# EAGLE design googleShoes_rev04_r (EAGLE 6.2)
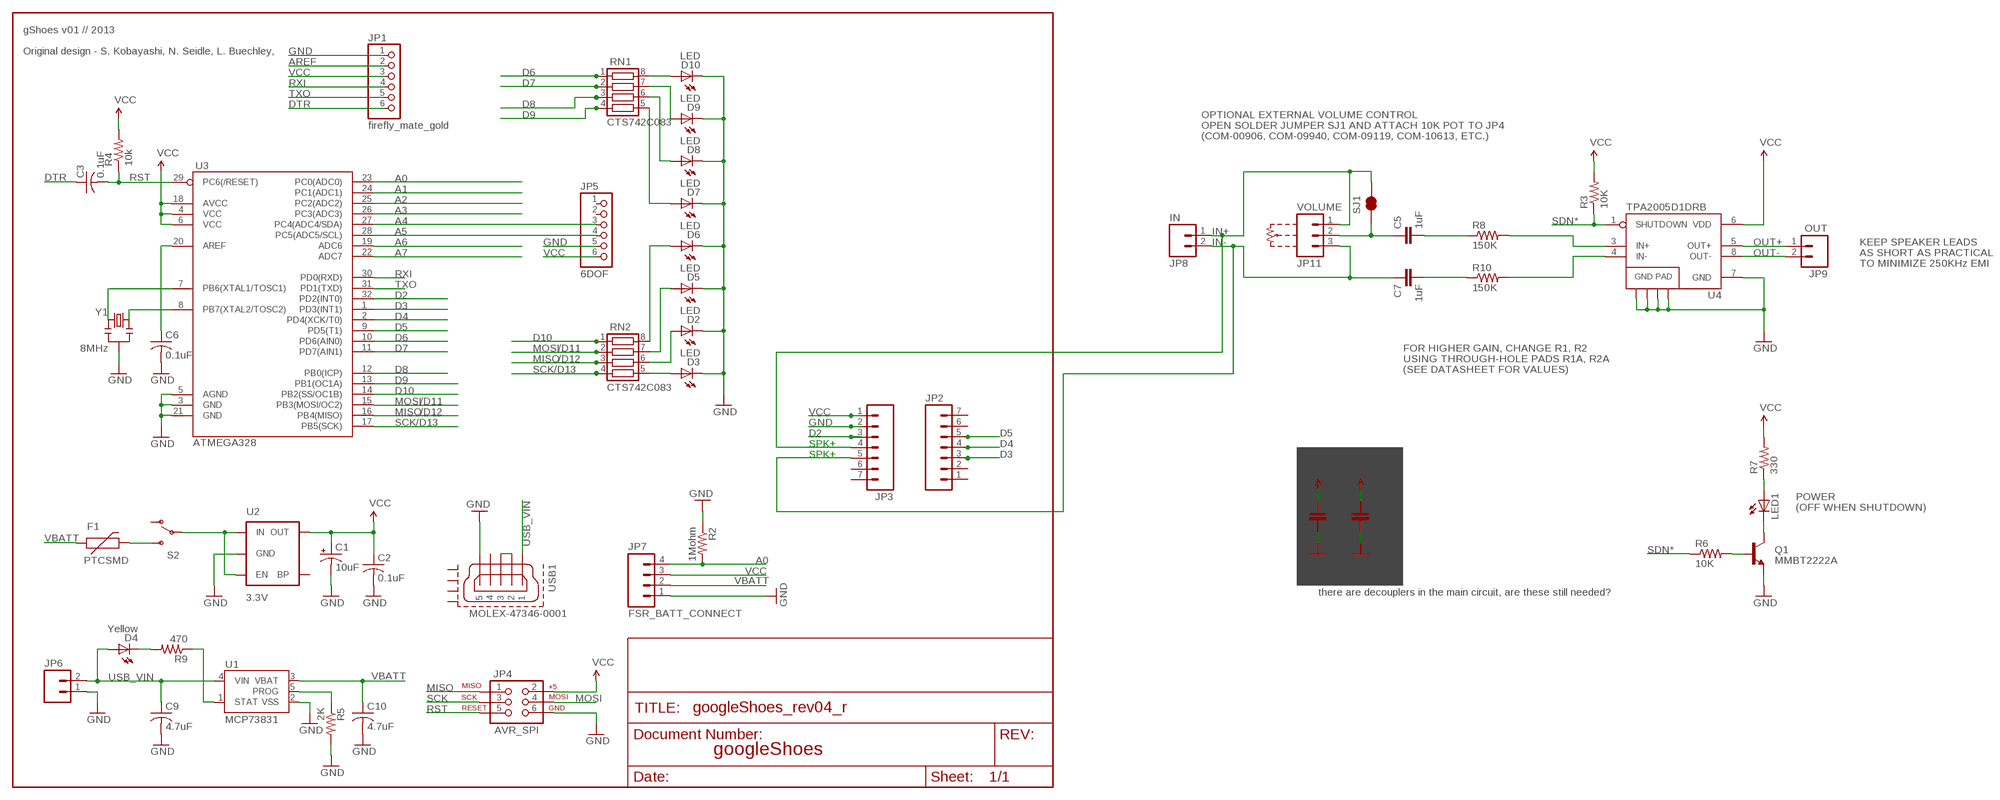
[diagram p0: schematic, sheet 1]

## Parts
C1  10uF  CAP_POL1206  [EIA3216]
C2  0.1uF  C-USC0805  [C0805]
C3  0.1uF  C-USC0805  [C0805]
C4  1uF  CAP1206  [1206]
C5  1uF  CAP1206  [1206]
C6  0.1uF  C-USC0805  [C0805]
C7  1uF  CAP1206  [1206]
C8  10uF  CAP1206  [1206]
C9  4.7uF  C-USC0805  [C0805]
C10  4.7uF  C-USC0805  [C0805]
D2  LED  LEDCHIP-LED0805  [CHIP-LED0805]
D3  LED  LEDCHIP-LED0805  [CHIP-LED0805]
D4  Yellow  LEDCHIP-LED0805  [CHIP-LED0805]
D5  LED  LEDCHIP-LED0805  [CHIP-LED0805]
D6  LED  LEDCHIP-LED0805  [CHIP-LED0805]
D7  LED  LEDCHIP-LED0805  [CHIP-LED0805]
D8  LED  LEDCHIP-LED0805  [CHIP-LED0805]
D9  LED  LEDCHIP-LED0805  [CHIP-LED0805]
D10  LED  LEDCHIP-LED0805  [CHIP-LED0805]
F1  PTCSMD  [PTC-1206]
JP1  firefly_mate_gold  PINHD-1X6B  [1X06-BIG]
JP2  M07  [1X07]
JP3  M07  [1X07]
JP4  AVR_SPI  AVR_SPI_PRG_6PTH  [2X3]
JP5  6DOF  PINHD-1X6B  [1X06-BIG]
JP6  M02PTH  [1X02]
JP7  FSR_BATT_CONNECT  M04PTH  [1X04]
JP8  IN  M02PTH  [1X02]
JP9  OUT  M02PTH  [1X02]
JP11  VOLUME  M03PTH  [1X03]
LED1  LEDCHIPLED_0805  [CHIPLED_0805]
Q1  MMBT2222A  TRANSISTOR_NPNSOT23-3  [SOT23-3]
R2  1Mohm  R-US_M0805  [M0805]
R3  10K  R-US_M0805  [M0805]
R4  10k  R-US_M0805  [M0805]
R5  2K  R-US_M0805  [M0805]
R6  10K  R-US_M0805  [M0805]
R7  330  R-US_M0805  [M0805]
R8  150K  R-US_M0805  [M0805]
R9  470  R-US_M0805  [M0805]
R10  150K  R-US_M0805  [M0805]
RN1  CTS742C083  [CTS742C083]
RN2  CTS742C083  [CTS742C083]
S2  SWITCH-SPSTSMD  [AYZ0202]
SJ1  SOLDERJUMPERNC2  [SJ_2S-NOTRACE]
U1  MCP73831  MCP73831SMD  [SOT23-5]
U2  3.3V  V_REG_LDOSMD  [SOT23-5]
U3  ATMEGA328  ATMEGA168  [TQFP32-08]
U4  TPA2005D1DRB  [QFN-8_PAD]
USB1  MOLEX-47346-0001  [MOLEX-47364-0001]
Y1  8MHz  RESONATORSMD  [RESONATOR-SMD]

## Nets
A0: JP7.4 R2.2 U3.23(PC0(ADC0))
A1: U3.24(PC1(ADC1))
A2: U3.25(PC2(ADC2))
A3: U3.26(PC3(ADC3))
A4: JP5.3 U3.27(PC4(ADC4/SDA))
A5: JP5.4 U3.28(PC5(ADC5/SCL))
A6: U3.19(ADC6)
A7: U3.22(ADC7)
AREF: C6.1 JP1.2 U3.20(AREF)
D2: JP3.3 U3.32(PD2(INT0))
D3: JP2.3 U3.1(PD3(INT1))
D4: JP2.4 U3.2(PD4(XCK/T0))
D5: JP2.5 U3.9(PD5(T1))
D6: RN1.1 U3.10(PD6(AIN0))
D7: RN1.2 U3.11(PD7(AIN1))
D8: RN1.3 U3.12(PB0(ICP))
D9: RN1.4 U3.13(PB1(OC1A))
D10: RN2.1 U3.14(PB2(SS/OC1B))
DTR: C3.1 JP1.6
GND: C1.C(-) C2.2 C4.2 C6.2 C8.2 C9.2 C10.2 D2.C D3.C D5.C D6.C D7.C D8.C D9.C D10.C JP1.1 JP3.2 JP4.6 JP5.5 JP6.1 JP7.1 Q1.2(E) R2.1 R5.2 U1.2(VSS) U2.2(GND) U3.3(GND) U3.5(AGND) U3.21(GND) U4.7(GND) U4.10(GND) U4.11(GND) U4.12(GND) U4.13(GND) USB1.5 Y1.2
IN+: JP3.4 JP8.1 JP11.1 SJ1.2
IN+AMP: R8.2 U4.3(IN+)
IN-: C7.1 JP3.5 JP8.2 JP11.3
IN-AMP: R10.2 U4.4(IN-)
MISO: JP4.1 RN2.3 U3.16(PB4(MISO))
MOSI: JP4.4 RN2.2 U3.15(PB3(MOSI/OC2))
N$1: C5.1 JP11.2 SJ1.1
N$3: D3.A RN2.5
N$4: D2.A RN2.6
N$5: S2.2(P) U2.1(IN) U2.3(EN)
N$6: D5.A RN2.7
N$7: D6.A RN2.8
N$8: D4.C R9.2
N$9: F1.2 S2.3(S)
N$10: U3.7(PB6(XTAL1/TOSC1)) Y1.3
N$11: R5.1 U1.5(PROG)
N$12: U3.8(PB7(XTAL2/TOSC2)) Y1.1
N$13: D10.A RN1.8
N$14: R9.1 U1.1(STAT)
N$15: D9.A RN1.7
N$16: D8.A RN1.6
N$17: D7.A RN1.5
N$18: LED1.A R7.1
N$19: Q1.1(B) R6.2
N$20: LED1.C Q1.3(C)
N$21: C5.2 R8.1
N$22: C7.2 R10.1
N$23: USB1.2 USB1.3
OUT+: JP9.1 U4.5(OUT+)
OUT-: JP9.2 U4.8(OUT-)
RST: C3.2 JP4.5 R4.1 U3.29(PC6(/RESET))
RXI: JP1.4 U3.30(PD0(RXD))
SCK: JP4.3 RN2.4 U3.17(PB5(SCK))
SDN*: R3.1 R6.1 U4.1(SHUTDOWN)
TXO: JP1.5 U3.31(PD1(TXD))
USB_VIN: C9.1 D4.A JP6.2 U1.4(VIN) USB1.1
VBATT: C10.1 F1.1 JP7.2 U1.3(VBAT)
VCC [VCC]: C1.A(+) C2.1 C4.1 C8.1 JP1.3 JP3.1 JP4.2 JP5.6 JP7.3 R3.2 R4.2 R7.2 U2.5(OUT) U3.4(VCC) U3.6(VCC) U3.18(AVCC) U4.6(VDD)
Unconnected: JP2.1 JP2.2 JP2.6 JP2.7 JP3.6 JP3.7 JP5.1 JP5.2 S2.1(O) U2.4(BP) USB1.4 USB1.GND1 USB1.GND2 USB1.GND3 USB1.GND4

## Notes on the sheet
- gShoes v01 // 2013
- Original design - S. Kobayashi, N. Seidle, L. Buechley,
- OPTIONAL EXTERNAL VOLUME CONTROL
- OPEN SOLDER JUMPER SJ1 AND ATTACH 10K POT TO JP4
- (COM-00906, COM-09940, COM-09119, COM-10613, ETC.)
- KEEP SPEAKER LEADS
- AS SHORT AS PRACTICAL
- TO MINIMIZE 250KHz EMI
- /D11 | FOR HIGHER GAIN, CHANGE R1, R2
- /D12 | USING THROUGH-HOLE PADS R1A, R2A
- /D13 | (SEE DATASHEET FOR VALUES)
- /D11
- /D12
- /D13
- SPK+
- SPK+
- POWER
- (OFF WHEN SHUTDOWN)
- there are decouplers in the main circuit, are these still needed?
- googleShoes

## Library data of the parts
C1 = SparkFun:CAP_POL: Capacitor Polarized These are standard SMD and PTH capacitors. Normally 10uF, 47uF, and 100uF in electrolytic and tantalum varieties. Always verify the external diameter of the through hole cap, it varies with capacity, voltage, and manufacturer. The EIA devices should be standard.
C2 C3 C6 C9 C10 = adafruit:C-US: CAPACITOR, American symbol
C4 C5 C7 C8 = SparkFun:CAP: Capacitor Standard 0603 ceramic capacitor, and 0.1" leaded capacitor.
D2-D10 = adafruit:LED: LED
F1 = SparkFun:PTC: Resettable Fuse PTC Resettable Fuse. Spark Fun Electronics SKU : COM-08357
JP1 JP5 = adafruit:PINHD-1X6: PIN HEADER
JP2 JP3 = SparkFun-Connectors:M07: Header 7 Standard 7-pin 0.1" header. Use with straight break away headers (SKU : PRT-00116), right angle break away headers (PRT-00553), swiss pins (PRT-00743), machine pins (PRT-00117), and female headers (PRT-00115). NOTES ON THE VARIANTS LOCK and LOCK_LONGPADS... This footprint was designed to help hold the alignment of a through-hole component (i.e. 7-pin header) while soldering it into place. You may notice that each hole has been shifted either up or down by 0.005 of an inch from it's more standard position (which is usually a perfectly straight line). This slight alteration caused the pins (the squares in the middle) to touch the edges of the holes. Because they are alternating, it causes a "brace" to hold the header in place. 0.005 has proven to be the perfect amount of "off-center" position when using our standard breakaway headers. Although looks a little odd when you look at the bare footprint, once you have a header in there, the alteration is very hard to notice. Also, if you push a header all the way into place, it is covered up entirely on the bottom side. This idea of altering the position of holes to aid alignment will be further integrated into the Sparkfun Library for other footprints. It can help hold any component with 3 or more connection pins.
JP4 = SparkFun:AVR_SPI_PRG_6: AVR ISP 6 Pin This is the reduced ISP connector for AVR programming. Common on Arduino. This footprint will take up less PCB space and can be used with a 10-pin to 6-pin adapter such as SKU: BOB-08508
JP6 JP8 JP9 = SparkFun:M02: Header 2 Standard 2-pin 0.1" header. Use with straight break away headers (SKU : PRT-00116), right angle break away headers (PRT-00553), swiss pins (PRT-00743), machine pins (PRT-00117), and female headers (PRT-00115). Molex polarized connector foot print use with SKU : PRT-08233 with associated crimp pins and housings.
JP7 = SparkFun-Connectors:M04: Header 4 Standard 4-pin 0.1" header. Use with straight break away headers (SKU : PRT-00116), right angle break away headers (PRT-00553), swiss pins (PRT-00743), machine pins (PRT-00117), and female headers (PRT-00115). Molex polarized connector foot print use with SKU : PRT-08231 with associated crimp pins and housings. 1MM SMD Version SKU: PRT-10208
JP11 = SparkFun:M03: Header 3 Standard 3-pin 0.1" header. Use with straight break away headers (SKU : PRT-00116), right angle break away headers (PRT-00553), swiss pins (PRT-00743), machine pins (PRT-00117), and female headers (PRT-00115). Molex polarized connector foot print use with SKU : PRT-08232 with associated crimp pins and housings.
LED1 = led:LED: LED
Q1 = SparkFun:TRANSISTOR_NPN: Transistor NPN BJT configuration in SOT23 package. MMBT2222 is the common NPN we use. Double check BCE configuration again layout.
R2 R4 R5 R9 = rcl:R-US_: RESISTOR, American symbol
R3 R6-R8 R10 = resistor:R-US_: RESISTOR, American symbol
RN1 RN2 = resistor-net:CTS742C083: Chip Resistor Array 4 Single Resistor Source: http://www.ctscorp.com/components/Datasheets/CTSChipArrayDs.pdf; OC_FARNELL: unknown; OC_NEWARK: unknown
S2 = SparkFun:SWITCH-SPST: SPST Switch Simple slide switch. Spark Fun Electronics SKU : COM-00102
SJ1 = SparkFun:SOLDERJUMPER: Solder Jumper Standard SMD solder jumper. Used to automate production. Two varients : Normally Open and Normally Closed are the same, but have different paste layers. NC will have a large amount of paste and should jumper during reflow.
U1 = SparkFun:MCP73831
U2 = SparkFun:V_REG_LDO: Voltage Regulator LDO Standard 150mA LDO voltage regulator in SOT-23 layout. Micrel part MIC5205. BP (by-pass) pin is used to lower output noise with 470pF cap.
U3 = SparkFun:ATMEGA168
U4 = mike-temp:TPA2005D1: 1.4W MONO CLASS-D AUDIO POWER AMPLIFIER The TPA2005D1 is a 1.4-W high efficiency filter-free class-D audio power amplifier in a BGA, QFN, or MSOP package that requires only three external components. Datasheet: http://focus.ti.com/lit/ds/symlink/tpa2005d1.pdf 1.4 W Into 8 ? From a 5V Supply at THD = 10% (Typ) Maximum Battery Life and Minimum Heat Efficiency With an 8-? Speaker: 84% at 400 mW, 79% at 100 mW 2.8-mA Quiescent Current 0.5-mA Shutdown Current Ideal for Wireless or Cellular Handsets and PDAs Capable of Driving an 8-? Speaker (2.5 V ? VDD ? 5.5 V) and a 4-? Speaker (2.5 V ? VDD ? 4.2 V) Only Three External Components Optimized PWM Output Stage Eliminates LC Output Filter Internally Generated 250-kHz Switching Frequency Eliminates Capacitor and Resistor Improved PSRR (-71 dB at 217 Hz) and Wide Supply Voltage (2.5 V to 5.5 V) Eliminates Need for a Voltage Regulator Fully Differential Design Reduces RF Rectification and Eliminates Bypass Capacitor Improved CMRR Eliminates Two Input Coupling Capacitors
USB1 = usb_con-update:MOLEX-47346-0001: MICRO USB B, BOTTOM MOUNT
Y1 = SparkFun:RESONATOR: Resonator Small SMD resonator. This is the itty bitty 10/20MHz resonators with built in caps. CSTCE10M0G55 and CSTCE20M0V53. Footprint has been reviewed closely but hasn't been tested yet.

## Net classes
0 Default: width 0.203 mm
1 VCC: width 0.381 mm
2 LEDPower: width 0.203 mm
3 ButtonSignal: width 0.203 mm

## Board
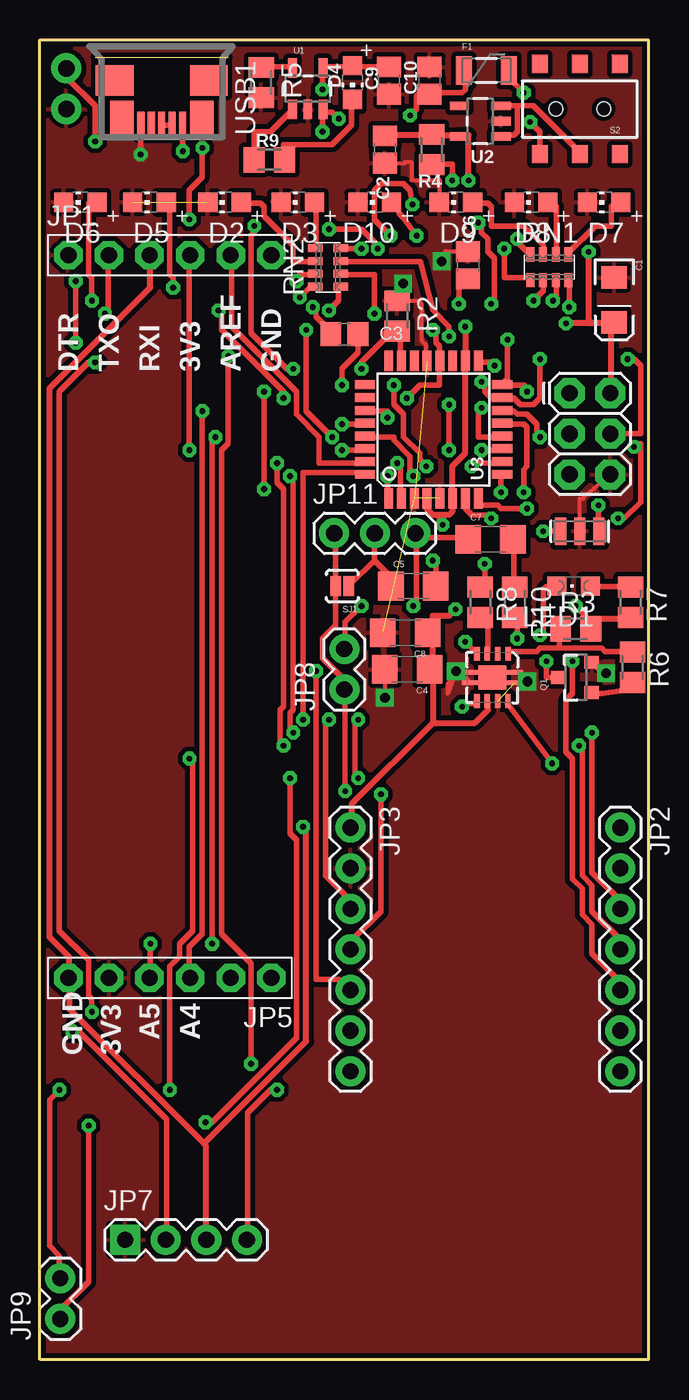
[diagram p1: board, top side]
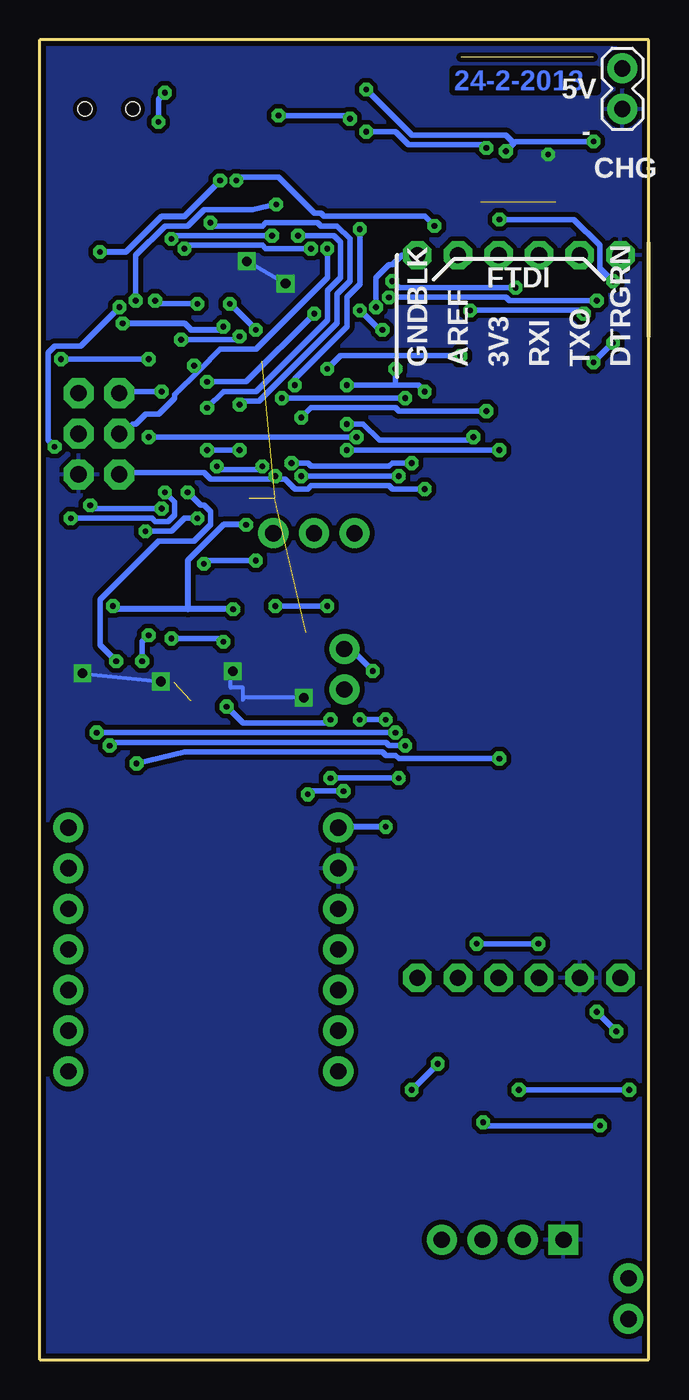
[diagram p2: board, bottom side, seen from below]

Size 38.1 x 82.55 mm. Coordinates in mm from the lower left corner, seen from the top.
Outline: 38.1,0 0,0 0,82.55 38.1,82.55 38.1,0
Copper layers (1*16): Top 0.035mm / dielectric 1.5mm / Bottom 0.035mm
Design rules: minimum track width 14mil, minimum drill 14mil, track to track 8mil, track to pad 8mil, pad to pad 8mil, via to via 4mil, smd to smd 8mil, copper to edge 8mil, drill to drill 8mil, minimum pad ring 12mil, minimum via ring 10mil, stop-mask expansion 4mil, vias tented up to drill 20mil, thermal gap 10mil

### Footprints (pad centres in the part's own frame; a part is rotated, then mirrored left to right if it is on the bottom)
EIA3216 = smd 1.4 x 1.6: A 1.4,0; C -1.4,0
C0805 = smd 1.3 x 1.5: 1 -0.85,0; 2 0.85,0
1206 = smd 1.6 x 1.8: 1 -1.4,0; 2 1.4,0
CHIP-LED0805 = smd 1.2 x 1.2: A 0,-1.05; C 0,1.05
PTC-1206 = smd 1 x 1.8: 1 -1.4,0; 2 1.4,0
1X06-BIG = drill 1.016 pad 1.778 octagon: 1 -6.35,0; 2 -3.81,0; 3 -1.27,0; 4 1.27,0; 5 3.81,0; 6 6.35,0
1X07 = drill 1.016 pad 1.88: 1 0,0; 2 2.54,0; 3 5.08,0; 4 7.62,0; 5 10.16,0; 6 12.7,0; 7 15.24,0
2X3 = drill 1.016 pad 1.88 octagon: 1 0,0; 2 0,2.54; 3 2.54,0; 4 2.54,2.54; 5 5.08,0; 6 5.08,2.54
1X02 = drill 1.016 pad 1.88: 1 0,0; 2 2.54,0
1X04 = drill 1.016 pad 1.88 square: 1 0,0 | drill 1.016 pad 1.88: 2 2.54,0; 3 5.08,0; 4 7.62,0
1X03 = drill 1.016 pad 1.88: 1 0,0; 2 2.54,0; 3 5.08,0
CHIPLED_0805 = smd 1.2 x 1.2: A 0,-1.05; C 0,1.05
SOT23-3 = smd 0.8 x 0.9: 1 -0.95,-1; 2 0.95,-1; 3 0,1.1
M0805 = smd 1.3 x 1.6: 1 -0.95,0; 2 0.95,0
CTS742C083 = smd 0.5 x 0.9: 1 -1.2,-0.8; 2 -0.4,-0.8; 3 0.4,-0.8; 4 1.2,-0.8; 5 1.2,0.8; 6 0.4,0.8; 7 -0.4,0.8; 8 -1.2,0.8
AYZ0202 = smd 1 x 1.15: 1 -2.5,2.825; 2 0,2.825; 3 2.5,2.825; 4 -2.5,-2.825; 5 0,-2.825; 6 2.5,-2.825 | hole 0.85: 1.5,0; -1.5,0
SJ_2S-NOTRACE = smd 0.635 x 1.27: 1 -0.401,0; 2 0.413,0
SOT23-5 = smd 0.55 x 1.2: 1 -0.95,-1.3; 2 0,-1.3; 3 0.95,-1.3; 4 0.95,1.3; 5 -0.95,1.3
TQFP32-08 = smd 1.27 x 0.559: 1 -4.293,2.8; 2 -4.293,2; 3 -4.293,1.2; 4 -4.293,0.4; 5 -4.293,-0.4; 6 -4.293,-1.2; 7 -4.293,-2; 8 -4.293,-2.8; 17 4.293,-2.8; 18 4.293,-2; 19 4.293,-1.2; 20 4.293,-0.4; 21 4.293,0.4; 22 4.293,1.2; 23 4.293,2; 24 4.293,2.8 | smd 0.559 x 1.27: 9 -2.8,-4.293; 10 -2,-4.293; 11 -1.2,-4.293; 12 -0.4,-4.293; 13 0.4,-4.293; 14 1.2,-4.293; 15 2,-4.293; 16 2.8,-4.293; 25 2.8,4.293; 26 2,4.293; 27 1.2,4.293; 28 0.4,4.293; 29 -0.4,4.293; 30 -1.2,4.293; 31 -2,4.293; 32 -2.8,4.293
QFN-8_PAD = smd 0.35 x 0.85: 1 -0.975,-1.475; 2 -0.325,-1.475; 3 0.325,-1.475; 4 0.975,-1.475; 5 0.975,1.475; 6 0.325,1.475; 7 -0.325,1.475; 8 -0.975,1.475 | smd 1.75 x 1.5: 9 0,0 | smd 1.025 x 0.28: 10 -1.387,-0.325; 11 1.387,-0.325; 12 1.387,0.325; 13 -1.387,0.325
MOLEX-47364-0001 = smd 1.7 x 0.45: 1 2.8,1.3; 2 2.8,0.65; 3 2.8,0; 4 2.8,-0.65; 5 2.8,-1.3 | smd 1.9 x 2.375: GND1 0,2.95; GND4 0,-2.95 | smd 2.1 x 1.475: GND2 2.3,2.5; GND3 2.3,-2.5
RESONATOR-SMD = smd 0.7 x 1.7: 1 -1.2,0; 2 0,0; 3 1.2,0

### Placement (x,y rotation side)
C1  35.94,66.29 270 top
C2  21.59,75.69 270 top
C3  19.05,64.14 0 top
C4  22.99,43.18 180 top
C5  23.37,48.39 0 top
C6  26.8,68.45 90 top
C7  28.19,51.31 0 top
C8  22.86,45.47 180 top
C9  21.84,80.01 270 top
C10  24.38,80.01 90 top
D2  11.56,72.39 90 top
D3  16.13,72.39 90 top
D4  19.56,79.88 180 top
D5  6.86,72.39 90 top
D6  2.54,72.39 90 top
D7  35.31,72.39 90 top
D8  30.73,72.39 90 top
D9  26.04,72.39 90 top
D10  20.95,72.39 90 top
F1  27.94,80.64 0 top
JP1  8.13,69.09 0 top
JP2  36.32,33.27 270 top
JP3  19.43,33.27 270 top
JP4  33.15,60.45 270 top
JP5  8.13,23.88 180 top
JP6  1.65,78.23 90 bottom
JP7  5.33,7.49 0 top
JP8  19.05,41.91 90 top
JP9  1.27,2.54 90 top
JP11  18.41,51.69 0 top
LED1  33.4,48.39 90 top
Q1  33.53,42.67 90 top
R2  22.35,65.28 270 top
R3  33.53,45.72 0 top
R4  24.51,75.69 90 top
R5  13.84,79.88 270 top
R6  37.08,43.31 270 top
R7  36.96,47.37 270 top
R8  27.56,47.37 270 top
R9  14.35,75.06 0 top
R10  29.72,47.37 270 top
RN1  31.88,68.33 0 top
RN2  18.03,68.33 90 top
S2  33.78,78.23 180 top
SJ1  18.92,48.39 180 top
U1  16.76,79.5 0 top
U2  27.56,77.47 90 top
U3  24.63,58.18 90 top
U4  28.32,42.67 180 top
USB1  7.62,80.01 270 top
Y1  33.78,51.82 180 top

### Tracks (layer width: path | path; a pad name or v marks a point on that pad's centre or on a via)
A0  (via drill 0.36)
  Top 0.356: U3.23 22.55,62.59 22.55,64.01 R2.2 22.55,64.21 21.54,64.21 21.54,63.8 20.12,62.38 v20.12,61.98 | v11.79,62.79 11.79,57.3 11.38,56.9 11.38,26.62 13.21,24.79 v13.21,18.49 | v14.83,16.87 14.43,16.87 13.01,15.44 13.01,7.52 JP7.4
  Bottom 0.356: v20.12,61.98 19.3,62.79 v11.79,62.79 | v14.83,16.87 v13.21,18.49
A4  (via drill 0.36)
  Top 0.356: v21.74,58.93 21.74,59.33 20.52,59.33 U3.27 | v10.16,59.33 10.16,26.62 9.35,25.81 9.35,23.98 JP5.3
  Bottom 0.356: v21.74,58.93 21.13,59.54 15.85,59.54 15.65,59.33 v10.16,59.33
A5  (via drill 0.36)
  Top 0.356: v18.9,58.52 20.32,58.52 U3.28 | v10.97,57.71 10.77,57.51 v10.77,26.01 | v6.91,26.01 6.91,23.98 JP5.4
  Bottom 0.356: v18.9,58.52 17.88,58.52 16.87,57.51 11.18,57.51 v10.97,57.71 | v6.91,26.01 v10.77,26.01
AREF  (via drill 0.36)
  Top 0.356: v24.59,64.41 24.79,64.21 24.79,63.6 24.99,63.4 24.99,62.59 U3.20 24.99,62.38 24.99,60.96 23.77,60.96 v22.96,60.15 | v26.21,66.04 26.21,67.67 26.62,67.67 C6.1 | v4.06,65.43 4.27,65.63 4.27,69.09 JP1.2 | v11.18,65.63 11.38,65.43 11.38,64.41 15.24,60.55 v15.24,60.15
  Bottom 0.356: v26.21,66.04 v24.59,64.41 | v4.06,65.43 4.27,65.63 v11.18,65.63 | v22.96,60.15 v15.24,60.15
D2  (via drill 0.36)
  Top 0.356: v16.46,40.03 16.46,55.47 20.32,55.47 U3.32 | v18.09,40.03 17.88,39.83 17.88,30.28 19.51,28.65 19.51,28.25 JP3.3
  Bottom 0.356: v18.09,40.03 v16.46,40.03
D3  (via drill 0.36)
  Top 0.356: v21.74,55.27 21.74,54.05 U3.1 | v15.65,55.27 15.85,55.07 15.85,40.64 15.65,40.44 15.65,39.42 v15.85,39.22 | v34.54,39.22 34.54,30.48 36.37,28.65 36.37,28.25 JP2.3
  Bottom 0.356: v15.65,55.27 v21.74,55.27 | v34.54,39.22 v15.85,39.22
D4  (via drill 0.36)
  Top 0.356: v22.35,56.08 22.55,55.88 22.55,54.05 U3.2 | v14.83,56.08 14.83,54.86 15.24,54.46 15.24,40.84 15.04,40.64 15.04,38.61 v15.24,38.41 | v33.73,38.41 33.93,38.2 33.93,30.28 34.54,29.67 34.54,28.04 36.37,26.21 36.37,25.81 JP2.4
  Bottom 0.356: v22.35,56.08 21.34,56.08 21.13,55.88 16.26,55.88 16.05,56.08 v14.83,56.08 | v15.24,38.41 16.26,38.41 16.46,38.61 33.53,38.61 v33.73,38.41
D5  (via drill 0.36)
  Top 0.356: v28.85,54.25 28.85,55.27 U3.9 | v33.33,43.69 33.33,41.66 32.92,41.25 32.92,38 33.33,37.59 33.33,30.07 33.93,29.46 33.93,27.84 34.54,27.23 34.54,25.4 36.37,23.57 36.37,23.16 JP2.5
  Bottom 0.356: v28.85,54.25 28.04,53.44 27.84,53.44 27.43,53.03 27.43,52.22 28.45,51.21 30.68,51.21 34.34,47.55 34.34,44.7 v33.33,43.69
D6  (via drill 0.36)
  Top 0.356: v29.06,69.49 29.06,67.67 30.48,67.67 RN1.1 | v21.13,69.49 20.93,69.7 20.93,69.9 20.12,70.71 v18.09,70.71 | v22.15,60.96 22.15,59.74 22.76,59.13 22.76,57.71 23.77,56.69 23.77,56.29 v24.18,55.88 | v27.03,55.88 27.23,56.08 28.85,56.08 U3.10
  Bottom 0.356: v29.06,69.49 28.85,69.7 24.18,69.7 23.98,69.49 v21.13,69.49 | v18.09,70.71 18.09,67.26 18.9,66.45 18.9,64.62 22.15,61.37 v22.15,60.96 | v24.18,55.88 24.38,55.68 26.82,55.68 v27.03,55.88
D7  (via drill 0.36)
  Top 0.356: v30.89,66.24 31.5,66.85 31.5,67.46 RN1.2 | v28.25,66.04 28.45,66.24 28.45,68.89 28.04,69.29 28.04,70.1 27.64,70.51 27.64,70.92 v27.43,71.12 | v25.6,56.9 v25.6,59.74 | v27.64,56.9 28.85,56.9 U3.11
  Bottom 0.356: v30.89,66.24 30.68,66.04 v28.25,66.04 | v27.43,71.12 27.23,70.92 24.18,70.92 23.98,71.12 20.73,71.12 20.52,70.92 19.51,70.92 18.69,70.1 18.69,67.46 19.51,66.65 19.51,64.82 24.38,59.94 25.4,59.94 v25.6,59.74 | v27.64,56.9 v25.6,56.9
D8  (via drill 0.36)
  Top 0.356: v27.64,59.54 27.43,59.33 27.43,57.71 28.85,57.71 U3.12 | v21.95,70.31 20.93,71.32 20.93,73.15 21.34,73.56 22.76,73.56 23.16,73.15 v23.32,72.26 | v32.11,66.24 32.31,66.24 32.31,67.46 RN1.3
  Bottom 0.356: v27.64,59.54 26.62,60.55 24.59,60.55 20.12,65.02 20.12,66.85 19.3,67.67 19.3,69.9 19.71,70.31 v21.95,70.31 | v23.32,72.26 24.79,71.93 27.84,71.93 28.85,70.92 30.28,70.92 32.11,69.09 v32.11,66.24
D9  (via drill 0.36)
  Top 0.356: v33.12,65.84 33.12,67.46 RN1.4 | v37.19,57.1 37.39,57.3 37.59,57.3 37.59,53.65 36.58,52.63 v36.17,52.63 | v30.28,54.25 30.28,55.68 30.48,55.88 30.48,58.32 30.28,58.52 29.06,58.52 U3.13
  Bottom 0.356: v33.12,65.84 35.56,63.4 37.19,63.4 37.59,62.99 37.59,57.51 v37.19,57.1 | v36.17,52.63 31.09,52.63 30.89,52.43 30.07,52.43 29.67,52.83 29.67,53.65 v30.28,54.25
D10  (via drill 0.36)
  Top 0.356: v18.09,65.63 18.69,66.24 18.69,67.06 RN2.1 | v16.66,64.41 16.66,59.33 v18.29,57.71 | v31.29,57.71 31.09,57.91 31.09,58.52 30.48,59.13 29.87,59.13 29.67,59.33 29.06,59.33 U3.14
  Bottom 0.356: v18.09,65.63 16.87,64.41 v16.66,64.41 | v31.29,57.71 v18.29,57.71
DTR  (via drill 0.36)
  Top 0.356: v17.07,65.84 17.27,65.63 17.27,65.23 18.09,64.41 18.29,64.41 18.29,64.21 C3.1
  Bottom 0.356: JP1.6 15.44,69.09 16.05,68.48 16.26,68.48 17.07,67.67 v17.07,65.84
GND  (via drill 0.36, 0.6 pad 0.41)  (5 unrouted)
  Top 0.254: C2.2 22.86,74.84 22.86,74.93 23.24,74.93 23.24,73.79 25.02,73.79 25.02,73.53 24.98,73.53 D9.C | Y1.2 33.78,53.85 34.04,53.85 34.04,53.98 34.67,54.48 JP4.6 | v22.73,67.31 22.86,67.31 22.61,67.06 R2.1 23.69,66.23 23.88,66.04 23.88,63.75 24.13,63.5 24.13,62.57 U3.21 | v25.15,68.71 24.89,68.83 25.4,69.34 26.76,69.34 C6.2 | Q1.2 34.53,43.58 35.05,43.05 v35.43,42.93 | v30.53,42.42 U4.13 | C4.2 v21.59,41.41 v21.59,41.4 | v26.04,43.05 25.53,41.66 25.53,42.29 26.29,43.05 26.29,42.99 U4.12
  Top 0.356: v6.3,75.39 6.3,77.01 USB1.5
  Bottom 0.254: v22.73,67.31 v25.15,68.71 | v35.43,42.93 v30.53,42.42 | v21.59,41.4 25.4,41.4 25.4,41.27 25.4,42.04 26.16,42.04 26.16,43.05 v26.04,43.05
  pour Top (isolate 0.305): 0,82.55 38.1,82.55 38.1,0 0,0
  pour Bottom (isolate 0.305): 0,82.55 38.1,82.55 38.1,0 0,0
IN+  (via drill 0.36)
  Top 0.356: JP11.1 18.49,51.61 18.49,48.56 SJ1.2 18.49,48.36 18.49,45.92 17.68,45.11 17.68,43.89 19.1,42.47 19.1,42.06 JP8.1 19.1,41.86 v19.1,35.56 | v21.34,35.36 21.34,28.04 19.51,26.21 19.51,25.81 JP3.4
  Bottom 0.356: v21.34,35.36 21.13,35.56 v19.1,35.56
IN+AMP
  Top 0.356: U4.3 28.04,44.3 28.04,46.13 27.64,46.53 R8.2
IN-  (via drill 0.36)
  Top 0.356: v20.12,47.14 19.1,46.13 19.1,44.5 JP8.2 | v23.37,47.14 23.57,47.35 23.57,51.41 | 23.57,51.41 23.57,51.61 JP11.3 23.57,51.41 | 23.57,51.41 26.62,51.41 C7.1 | v17.27,43.08 17.27,23.77 18.69,23.77 19.3,23.16 JP3.5
  Bottom 0.356: v23.37,47.14 v20.12,47.14 | v17.27,43.08 18.69,44.5 18.9,44.5 JP8.2
IN-AMP  (via drill 0.36)
  Top 0.356: v26.62,44.91 27.23,44.3 U4.4 | v29.87,45.11 29.87,46.33 R10.2
  Bottom 0.356: v26.62,44.91 26.82,45.11 v29.87,45.11
MISO  (via drill 0.36)
  Top 0.356: v30.48,60.55 30.48,60.76 30.28,60.96 29.06,60.96 U3.16 29.06,61.16 29.26,61.37 v29.26,63.8 | v25.6,64.01 25.6,64.62 24.59,65.63 23.82,68.68 18.9,68.68 RN2.3
  Bottom 0.356: v30.48,60.55 33.12,60.55 JP4.1 | v25.6,64.01 25.81,63.8 v29.26,63.8
MOSI  (via drill 0.36)
  Top 0.356: v20.93,65.43 20.93,67.87 18.9,67.87 RN2.2 | v27.64,61.16 27.84,60.96 27.84,60.55 28.25,60.15 28.85,60.15 U3.15 29.06,60.15 29.67,60.15 30.07,59.74 30.89,59.74 31.29,60.15 v31.29,62.59 | JP4.4 37.59,57.91 37.59,62.18 37.19,62.59 v36.78,62.59
  Bottom 0.356: v20.93,65.43 25.2,61.16 v27.64,61.16 | v31.29,62.59 v36.78,62.59
N$1
  Top 0.356: 20.93,49.99 19.51,48.56 SJ1.1 | 20.93,49.99 20.93,51.61 JP11.2 | 20.93,49.99 21.95,48.97 21.95,48.56 C5.1
N$3
  Top 0.356: D3.A 17.27,72.34 17.27,69.7 RN2.5
N$4
  Top 0.356: RN2.6 17.07,68.68 15.85,68.68 15.85,69.7 14.02,71.53 14.02,72.14 13.82,72.34 12.8,72.34 D2.A
N$5
  Top 0.356: 29.87,78.44 29.06,78.44 U2.3 | 29.87,78.44 29.87,76.81 29.67,76.61 29.06,76.61 U2.1 | 29.87,78.44 30.89,78.44 33.73,75.59 S2.2
N$6  (via drill 0.36)
  Top 0.356: v16.05,67.46 16.26,67.67 16.26,67.87 17.07,67.87 RN2.7 | v8.33,67.06 8.33,67.67 8.13,67.87 8.13,72.34 7.92,72.54 D5.A
  Bottom 0.356: v16.05,67.46 15.65,67.06 v8.33,67.06
N$7  (via drill 0.36)
  Top 0.356: v16.26,66.45 16.87,67.06 17.07,67.06 RN2.8 | v3.25,66.24 3.25,67.67 3.05,67.87 3.05,72.34 3.45,72.34 D6.A
  Bottom 0.356: v16.26,66.45 8.94,66.45 8.74,66.24 v3.25,66.24
N$8
  Top 0.356: D4.C 19.51,78.64 19.51,77.22 18.29,76 15.24,76 15.24,75.18 R9.2
N$9  (via drill 0.36)
  Top 0.356: v30.68,77.42 31.29,76.81 31.29,75.59 S2.3 | v30.28,79.25 29.26,80.26 29.26,80.47 F1.2
  Bottom 0.356: v30.68,77.42 30.68,78.84 v30.28,79.25
N$10  (via drill 0.36)
  Top 0.356: v31.5,51.82 Y1.3 | v28.25,52.63 28.04,52.83 27.03,52.83 26.62,53.24 26.62,53.85 U3.7
  Bottom 0.356: v31.5,51.82 29.87,51.82 29.06,52.63 v28.25,52.63
N$11
  Top 0.356: U1.5 15.65,80.87 14.02,80.87 R5.1
N$12  (via drill 0.36)
  Top 0.356: v34.95,53.44 34.95,51.82 Y1.1 | v30.48,53.24 28.85,53.24 28.65,53.44 27.43,53.44 27.43,53.85 U3.8
  Bottom 0.356: v34.95,53.44 34.75,53.24 v30.48,53.24
N$13  (via drill 0.36)
  Top 0.356: v29.87,70.1 29.87,69.9 30.48,69.29 RN1.8 | v23.57,70.31 22.68,71.5 22.48,71.7 22.15,72.34 D10.A
  Bottom 0.356: v29.87,70.1 29.67,70.31 v23.57,70.31
N$14
  Top 0.356: U1.1 15.65,78.03 14.43,76.81 13.41,76.81 13.41,75.18 R9.1
N$15
  Top 0.356: RN1.7 31.5,69.29 31.5,69.7 30.28,70.92 28.25,70.92 28.25,72.14 28.04,72.34 27.23,72.34 D9.A
N$16
  Top 0.356: RN1.6 32.31,69.29 32.31,72.14 31.9,72.54 D8.A
N$17
  Top 0.356: RN1.5 33.12,69.29 34.75,70.92 35.76,70.92 35.76,72.14 36.17,72.54 D7.A
N$18
  Top 0.356: LED1.A 34.54,48.36 36.58,48.36 R7.1
N$19
  Top 0.356: Q1.1 34.54,41.66 35.15,41.66 37.19,41.94 36.88,42.01 36.58,42.27 R6.2
N$20  (via drill 0.36)
  Top 0.356: Q1.3 31.7,42.67 v31.7,43.69 | v31.29,45.31 31.5,45.52 31.5,48.16 31.7,48.36 32.31,48.36 LED1.C
  Bottom 0.356: v31.7,43.69 31.7,44.91 v31.29,45.31
N$21  (via drill 0.36)
  Top 0.356: v27.84,49.78 27.84,48.36 27.64,48.36 R8.1 | v24.59,49.99 24.79,49.78 24.79,48.56 C5.2
  Bottom 0.356: v27.84,49.78 27.64,49.99 v24.59,49.99
N$22
  Top 0.356: C7.2 29.67,51.21 29.67,48.36 R10.1
N$23
  Top 0.356: USB1.2 8.13,77.22 7.72,77.22 USB1.3
OUT+  (via drill 0.36)
  Top 0.356: v26.42,40.84 26.42,41.05 27.23,41.05 U4.5 | v19.91,40.03 19.71,39.83 19.71,36.58 v19.91,36.37 | v15.65,36.37 15.65,32.92 16.05,32.51 16.05,20.12 10.77,14.83 v10.36,14.83 | v3.05,14.63 3.05,4.88 1.22,3.05 1.22,2.64 JP9.1
  Bottom 0.356: v26.42,40.84 25.4,39.83 20.12,39.83 v19.91,40.03 | v15.65,36.37 v19.91,36.37 | v10.36,14.83 10.16,14.63 v3.05,14.63
OUT-  (via drill 0.36)
  Top 0.356: v32.05,37.29 29.26,41.05 U4.8 | v9.35,37.59 9.55,37.39 9.55,26.82 8.74,26.01 8.74,25.2 8.13,24.59 v8.13,16.87 | v1.22,16.87 0.61,16.26 0.61,7.11 1.22,6.5 1.22,5.08 JP9.2
  Bottom 0.356: v32.05,37.29 29.06,38 16.66,38 16.46,37.8 15.85,37.8 15.65,37.59 v9.35,37.59 | v1.22,16.87 v8.13,16.87
RST  (via drill 0.36)
  Top 0.356: v14.02,60.55 v14.02,54.46 | v18.9,60.96 18.9,61.98 19.91,62.99 19.91,64.01 C3.2 | v23.37,55.27 23.16,55.47 23.16,56.49 22.15,57.51 22.15,57.71 20.52,57.71 U3.29 | v25.81,73.76 25.81,74.78 24.38,74.78 R4.1 | v13.41,70.92 13.41,70.51 13.21,70.31 13.21,64.21 15.44,61.98 v15.85,61.98
  Bottom 0.356: 23.37,55.07 22.76,55.07 22.15,54.46 21.34,54.46 21.13,54.66 16.26,54.66 16.05,54.46 v14.02,54.46 | 23.37,55.07 27.43,55.07 27.84,55.47 33.12,55.47 JP4.5 | v14.02,60.55 14.43,60.96 15.85,60.96 | v18.9,60.96 15.85,60.96 | 23.37,55.07 v23.37,55.27 | v25.81,73.76 25.6,73.97 23.16,73.97 20.93,71.73 20.52,71.73 20.32,71.53 14.02,71.53 v13.41,70.92 | 15.85,60.96 v15.85,61.98
RXI  (via drill 0.36)
  Top 0.356: v18.9,56.9 20.32,56.9 U3.30 | v9.35,56.9 9.35,69.09 JP1.4
  Bottom 0.356: v9.35,56.9 v18.9,56.9
SCK  (via drill 0.36)
  Top 0.356: v20.12,69.49 18.9,69.49 RN2.4 | v28.45,62.18 28.25,62.38 27.43,62.38 U3.17
  Bottom 0.356: v20.12,69.49 20.12,67.67 24.59,63.2 26.82,63.2 28.14,61.87 | 28.14,61.87 29.67,60.35 29.67,60.15 30.68,59.13 31.5,59.13 32.11,58.52 32.31,58.52 32.92,57.91 JP4.3 | 28.14,61.87 v28.45,62.18
SDN*
  Top 0.356: 32.51,44.5 31.29,44.5 31.09,44.3 29.46,44.3 U4.1 | 32.51,44.5 32.51,45.72 R3.1 | 32.51,44.5 35.15,44.5 35.36,44.3 36.58,44.3 R6.1
TXO
  Top 0.356: U3.31 20.32,56.08 17.48,56.08 17.48,57.71 16.05,59.13 16.05,60.55 11.99,64.62 11.99,69.09 JP1.5
USB_VIN  (via drill 0.36)
  Top 0.356: C9.1 21.74,80.87 19.71,80.87 D4.A 19.51,80.87 17.88,80.87 U1.4 17.68,80.67 v17.68,79.45 | v8.94,75.59 8.94,77.01 USB1.1 | v3.45,76.2 3.45,78.44 1.63,80.26 1.63,80.67 JP6.2
  Bottom 0.356: 8.43,76.1 8.33,76.2 v3.45,76.2 | 8.43,76.1 v8.94,75.59 | v17.68,79.45 14.83,76.61 8.94,76.61 8.43,76.1
VBATT  (via drill 0.36)
  Top 0.356: v18.69,77.62 18.29,78.03 17.88,78.03 U1.3 17.68,78.03 v17.68,76.81 | v23.16,77.83 23.57,78.23 23.57,79.05 23.77,79.25 24.38,79.25 | 24.38,79.25 26.42,79.25 26.62,79.45 26.62,80.47 F1.1 | 24.38,79.25 C10.1 | v2.03,20.52 2.44,20.52 7.92,15.04 7.92,7.52 JP7.2 | v3.25,21.74 3.25,22.55 3.05,22.76 3.05,24.99 1.22,26.82 1.22,60.55 3.05,62.38 v3.45,62.38 | v2.23,67.46 v2.23,63.6 | v9.35,71.32 9.35,73.15 10.16,73.97 v10.16,75.79
  Bottom 0.356: v18.69,77.62 18.9,77.83 v23.16,77.83 | v3.25,21.74 v2.03,20.52 | v2.23,63.6 v3.45,62.38 | v2.23,67.46 3.05,68.28 3.05,69.7 4.67,71.32 v9.35,71.32 | v10.16,75.79 10.36,76 15.04,76 15.85,76.81 v17.68,76.81
VCC  (via drill 0.36)
  Top 0.381: R7.2 36.58,46.33 34.75,46.33 34.54,46.13 34.54,45.72 R3.2 34.34,45.72 34.14,45.92 34.14,46.53 v33.53,47.14 | 24.59,39.83 27.23,39.83 28.04,40.64 28.04,41.05 U4.6 | 24.59,39.83 24.59,43.08 C4.1 24.59,43.28 24.59,45.52 C8.1 24.59,45.72 24.59,46.53 25.6,46.53 v26.01,46.94 | 24.59,39.83 19.51,34.75 19.51,33.33 JP3.1 | 24.99,52.83 25.6,52.83 25.81,53.03 25.81,53.85 U3.6 25.81,54.05 25.81,55.88 26.62,56.69 26.62,62.38 U3.18 26.62,62.59 v26.62,64.62 | 24.99,52.83 24.59,52.83 24.18,53.24 24.18,53.85 U3.4 | 24.38,76.61 26.21,76.61 U2.5 26.42,76.61 26.82,76.61 v26.82,73.76 | 24.38,76.61 21.74,76.61 C2.1 | 24.38,76.61 R4.2 | JP4.2 35.76,60.55 35.76,64.82 C1.A 35.56,64.82 34.54,64.82 34.44,64.92 | v34.34,69.29 34.34,65.02 34.44,64.92 | v32.92,64.82 34.34,64.82 34.44,64.92 | v25.2,52.22 24.99,52.43 24.99,52.83 | 10.26,13.51 1.83,21.95 1.83,23.77 JP5.6 1.83,23.98 1.83,25.2 0.61,26.42 0.61,60.76 6.91,67.06 6.91,69.09 JP1.3 | 10.26,13.51 10.36,13.41 10.36,7.52 JP7.3 | v16.46,33.33 16.66,33.12 16.66,19.91 10.26,13.51
  Bottom 0.381: v33.53,47.14 33.33,46.94 28.85,46.94 | v26.01,46.94 28.85,46.94 | v26.82,73.76 29.06,71.53 30.48,71.53 32.72,69.29 v34.34,69.29 | v26.62,64.62 26.82,64.41 28.65,64.41 29.06,64.82 v32.92,64.82 | 28.85,46.94 28.85,49.99 26.62,52.22 v25.2,52.22 | v16.46,33.33 19.3,33.33 JP3.1

### Text on the board
Bottom: 24-2-2013
tPlace: googleShoes | v01 | D2 | D3* | A0 | DTR | TXO | RXI | 3V3 | AREF | GND | ON | CHG | A5 | A4 | GND | 3V3
bPlace: 5V | BAT | - | CHG | FTDI | GRN | BLK | DTR | TXO | RXI | 3V3 | AREF | GND | - | +
_bsilk: 6DOF